# Altium schematic sheet MB1296-USB_Antenna.SchDoc: LoRa USB - Antenna
size A4; Date: 18-AUG-2016; Organization: STMicroelectronics; Address1: Microcontrollers Division; Address2: 190, avenue Célestin COQ; Address3: 13106 ROUSSET Cedex; Address4: FRANCE; DocumentNumber: MB1296; Revision: C-01; SheetNumber: 5; SheetTotal: 6; Project: STM32 LoRa Discovery
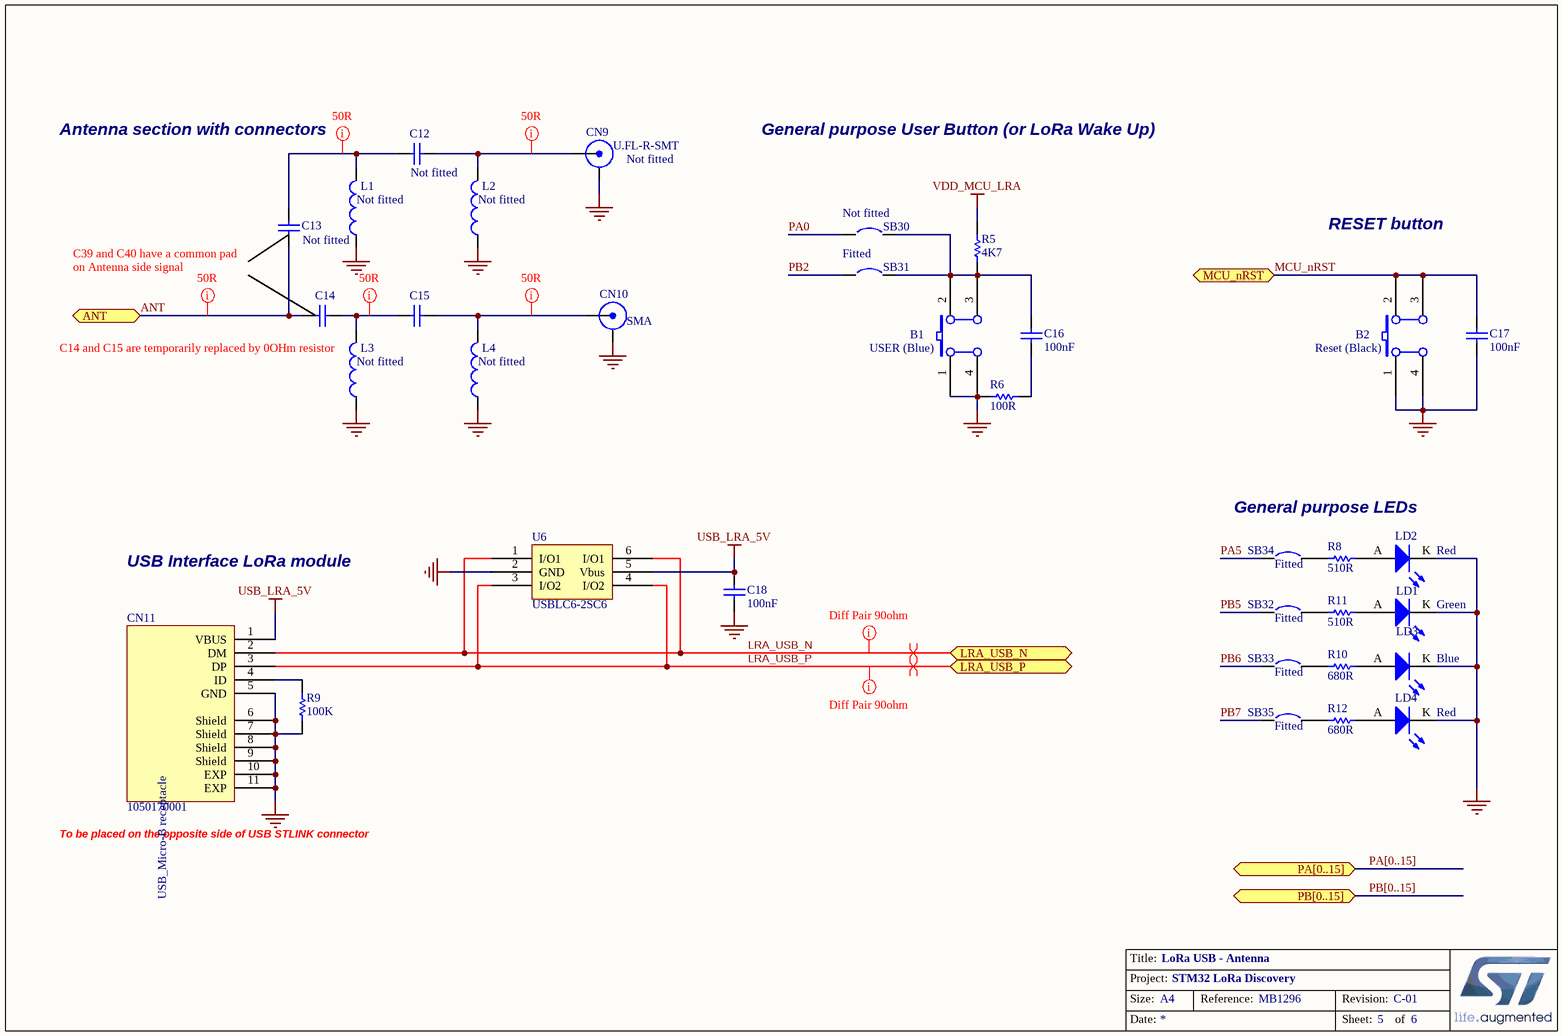
[diagram p0: MB1296-USB_Antenna.SchDoc]

## Parts
B1  USER (Blue)  [PB10]
B2  Reset (Black)  [PB10]
C12  (no value)  [0402]
C13  (no value)  [0402]
C14  (no value)  [0402]
C15  (no value)  [0402]
C16  100nF  [0603C]
C17  100nF  [0603C]
C18  100nF  [0603C]
CN9  U.FL-R-SMT  [UFL-SMD]
CN10  SMA  [SMA_COMBO_B]
CN11  1050170001  [Molex_1050170001]
L1  (no value)  [0402]
L2  (no value)  [0402]
L3  (no value)  [0402]
L4  (no value)  [0402]
LD1  Green  [0603D]
LD2  Red  [0603D]
LD3  Blue  [0603D]
LD4  Red  [0603D]
R5  4K7  [0603R]
R6  100R  [0603R]
R8  510R  [0603R]
R9  100K  [0603]
R10  680R  [0603R]
R11  510R  [0603R]
R12  680R  [0603R]
SB30  Circuit Breaker  [JP2_SMD]  (value not drawn)
SB31  Circuit Breaker  [JP2_SMD]  (value not drawn)
SB32  Circuit Breaker  [JP2_SMD]  (value not drawn)
SB33  Circuit Breaker  [JP2_SMD]  (value not drawn)
SB34  Circuit Breaker  [JP2_SMD]  (value not drawn)
SB35  Circuit Breaker  [JP2_SMD]  (value not drawn)
U6  USBLC6-2SC6  [SOT23-6L]

## Ports
ANT, LRA_USB_N, LRA_USB_P, MCU_nRST, PA[0..15] (bidir), PB[0..15] (bidir)

## Nets
GND: B1.1(A0) B1.4(A1) B2.1(A0) B2.4(A1) C17.1 C18.1 CN9.2(Y) CN10.2(Y) CN11.5(GND) CN11.6(Shield) CN11.7(Shield) CN11.8(Shield) CN11.9(Shield) CN11.10(EXP) CN11.11(EXP) L1.1 L2.1 L3.1 L4.1 LD1.K LD2.K LD3.K LD4.K R6.2 R9.1 U6.2(GND)
USB_LRA_5V: C18.2 CN11.1(VBUS) U6.5(Vbus)
VDD_MCU_LRA: R5.2
ANT: C13.2 C14.1 ; port ANT
LRA_USB_N: CN11.2(DM) U6.1(I/O1) U6.6(I/O1) ; port LRA_USB_N
LRA_USB_P: CN11.3(DP) U6.3(I/O2) U6.4(I/O2) ; port LRA_USB_P
MCU_nRST: B2.2(B0) B2.3(B1) C17.2 ; port MCU_nRST
PA0: SB30.1
PA5: SB34.1
PB2: SB31.1
PB5: SB32.1
PB6: SB33.1
PB7: SB35.1
NetB1_2: B1.2(B0) B1.3(B1) C16.2 R5.1 SB30.2 SB31.2
NetC12_1: C12.1 C13.1 L1.2
NetC12_2: C12.2 CN9.1(X) L2.2
NetC14_2: C14.2 C15.1 L3.2
NetC15_2: C15.2 CN10.1(X) L4.2
NetC16_1: C16.1 R6.1
NetCN11_4: CN11.4(ID) R9.2
NetLD1_A: LD1.A R11.2
NetLD2_A: LD2.A R8.2
NetLD3_A: LD3.A R10.2
NetLD4_A: LD4.A R12.2
NetR8_1: R8.1 SB34.2
NetR10_1: R10.1 SB33.2
NetR11_1: R11.1 SB32.2
NetR12_1: R12.1 SB35.2

## Buses and harness runs
bus PA[0..15] = port PA[0..15]
bus PB[0..15] = port PB[0..15]

## Layout directives
mark named Diff Pair 90ohm: LRA_USB_N, LRA_USB_P
differential pair: LRA_USB_N, LRA_USB_P
net class 50R; rule Clearance Constraint [Clearance = 6.2mil]: ANT, NetC12_1, NetC12_2, NetC14_2, NetC15_2

## Notes on the sheet
- Antenna section with connectors
- Not fitted
- (near CN9) Not fitted
- General purpose User Button (or LoRa Wake Up)
- (near L1) Not fitted
- (near L2) Not fitted
- (near SB30) Not fitted
- RESET button
- (near C13) C39 and C40 have a common pad
- on Antenna side signal
- Fitted
- (near L3) C14 and C15 are temporarily replaced by 0OHm resistor
- (near L3) Not fitted
- (near L4) Not fitted
- General purpose LEDs
- USB Interface LoRa module
- (near SB34) Fitted
- (near SB32) Fitted
- (near SB33) Fitted
- (near SB35) Fitted
- (near CN11) To be placed on the opposite side of USB STLINK connector
- Title:
- Project:
- Size:
- Date:
- A4
- Reference:
- Sheet:
- Revision:
- of
- (in symbol 1050170001) USB_Micro-B receptacle

## Library data of the parts
B1 = SW PUSHBUTTON: SE PUSHBUTTON; Manufacturer: wealthmetal; Manufacturer P/N: TD0341X-G01-BLU; Provided by: Subcon; ECCN_US/UE: *; Fitted: *; Order Code Digikey: *; Order Code Farnell: *; Order Code RS: *; Value: *
B2 = SW PUSHBUTTON: SE PUSHBUTTON; Manufacturer: wealthmetal; Manufacturer P/N: TD0341X-G01-BLA; Provided by: Subcon; ECCN_US/UE: *; Fitted: *; Order Code Digikey: *; Order Code Farnell: *; Order Code RS: *; Value: *
C12 C13 = CAP SMD 0402 NPO 18PF 16V 5%: 0402; Fitted: No; Manufacturer: *; Manufacturer P/N: *; Order code Farnell: *; Order code RS: *; Value: *; ECCN_US/UE: *; Order Code Digikey: *; Provided by: *
C14 C15 = CAP SMD 0402 NPO 18PF 16V 5%: 0402; Fitted: Yes 0Ohm resistor; Manufacturer: *; Manufacturer P/N: *; Order code Farnell: *; Order code RS: *; Value: *; ECCN_US/UE: *; Order Code Digikey: *; Provided by: *
C16-C18 = CAP: Capacitor 100nF; Manufacturer: YAGEO; Manufacturer P/N: CC0603KRX7R9BB104; Provided by: Subcon; Revision: July-2002: Re-released for DXP Platform.; Value: 100nF; ECCN_US/UE: *; Fitted: *; Order Code Digikey: *; Order Code Farnell: *; Order Code RS: *
CN9 = UFL
CN11 = 1050170001: Silkscreen: USB
L1-L4 = BLM15HG102SN1D: Fitted: No; Manufacturer: *; Manufacturer P/N: *; Order Code Mouser: *; ECCN_US/UE: *; Order Code Digikey: *; Order Code Farnell: *; Order Code RS: *; Provided by: *; Value: *
LD1-LD4 = LED2: Typical RED, GREEN, YELLOW, AMBER GaAs LED; Manufacturer: Everlight; Manufacturer P/N  Green: 19-213SY6C/S530-E2/TR8LED; Manufacturer P/N  Red: 19-213-R6C-AP1Q2B-3T; Revision: July-2002: Re-released for DXP Platform.; ECCN_US/UE: *; Fitted: *; Order Code Digikey: *; Order Code Farnell: *; Order Code RS: *; Provided by: *; Value: *
R5 = res1_4: Resistor; Manufacturer: YAGEO; Manufacturer P/N: RC0603FR-074K7L; Provided by: Subcon; Revision: July-2002: Re-released for DXP Platform.; ECCN_US/UE: *; Fitted: *; Order Code Digikey: *; Order Code Farnell: *; Order Code RS: *; Value: 4K7
R6 = res1_4: Resistor; Manufacturer: YAGEO; Manufacturer P/N: RC0603FR-07100RL; Provided by: Subcon; Revision: July-2002: Re-released for DXP Platform.; ECCN_US/UE: *; Fitted: *; Order Code Digikey: *; Order Code Farnell: *; Order Code RS: *; Value: 100R
R8 R11 = res1_4: Resistor; Manufacturer: YAGEO; Manufacturer P/N: RC0603FR-07510RL; Provided by: Subcon; Revision: July-2002: Re-released for DXP Platform.; ECCN_US/UE: *; Fitted: *; Order Code Digikey: *; Order Code Farnell: *; Order Code RS: *; Value: 510R
R9 = RES SMD 0603 100K 75V 5% 0.1W: 0603 100K 75V 5% 0.1W; Manufacturer: YAGEO; Manufacturer P/N: RC0603FR-07100KL; Provided by: Subcon; Order code Farnell: 1692517; Value: 100K; ECCN_US/UE: *; Fitted: *; Order Code Digikey: *
R10 R12 = res1_4: Resistor; Manufacturer: YAGEO; Manufacturer P/N: RC0603FR-07680RL; Provided by: Subcon; Revision: July-2002: Re-released for DXP Platform.; ECCN_US/UE: *; Fitted: *; Order Code Digikey: *; Order Code Farnell: *; Order Code RS: *; Value: 680R
SB30 = Circuit Breaker: Fitted: No; Revision: July-2002: Re-released for DXP Platform.; ECCN_US/UE: *; Manufacturer: *; Manufacturer P/N: *; Order Code Digikey: *; Order Code Farnell: *; Order Code RS: *; Provided by: *; Value: *
SB31-SB35 = Circuit Breaker: Fitted: Yes; Revision: July-2002: Re-released for DXP Platform.; ECCN_US/UE: *; Manufacturer: *; Manufacturer P/N: *; Order Code Digikey: *; Order Code Farnell: *; Order Code RS: *; Provided by: *; Value: *
U6 = USBLC6-2SC6: Manufacturer: STMicroelectronics; Manufacturer P/N: USBLC6-4SC6; ECCN_US/UE: EAR99/NEC; Provided by: STM; Fitted: *; Order Code Digikey: *; Order Code Farnell: *; Order Code RS: *; Value: *